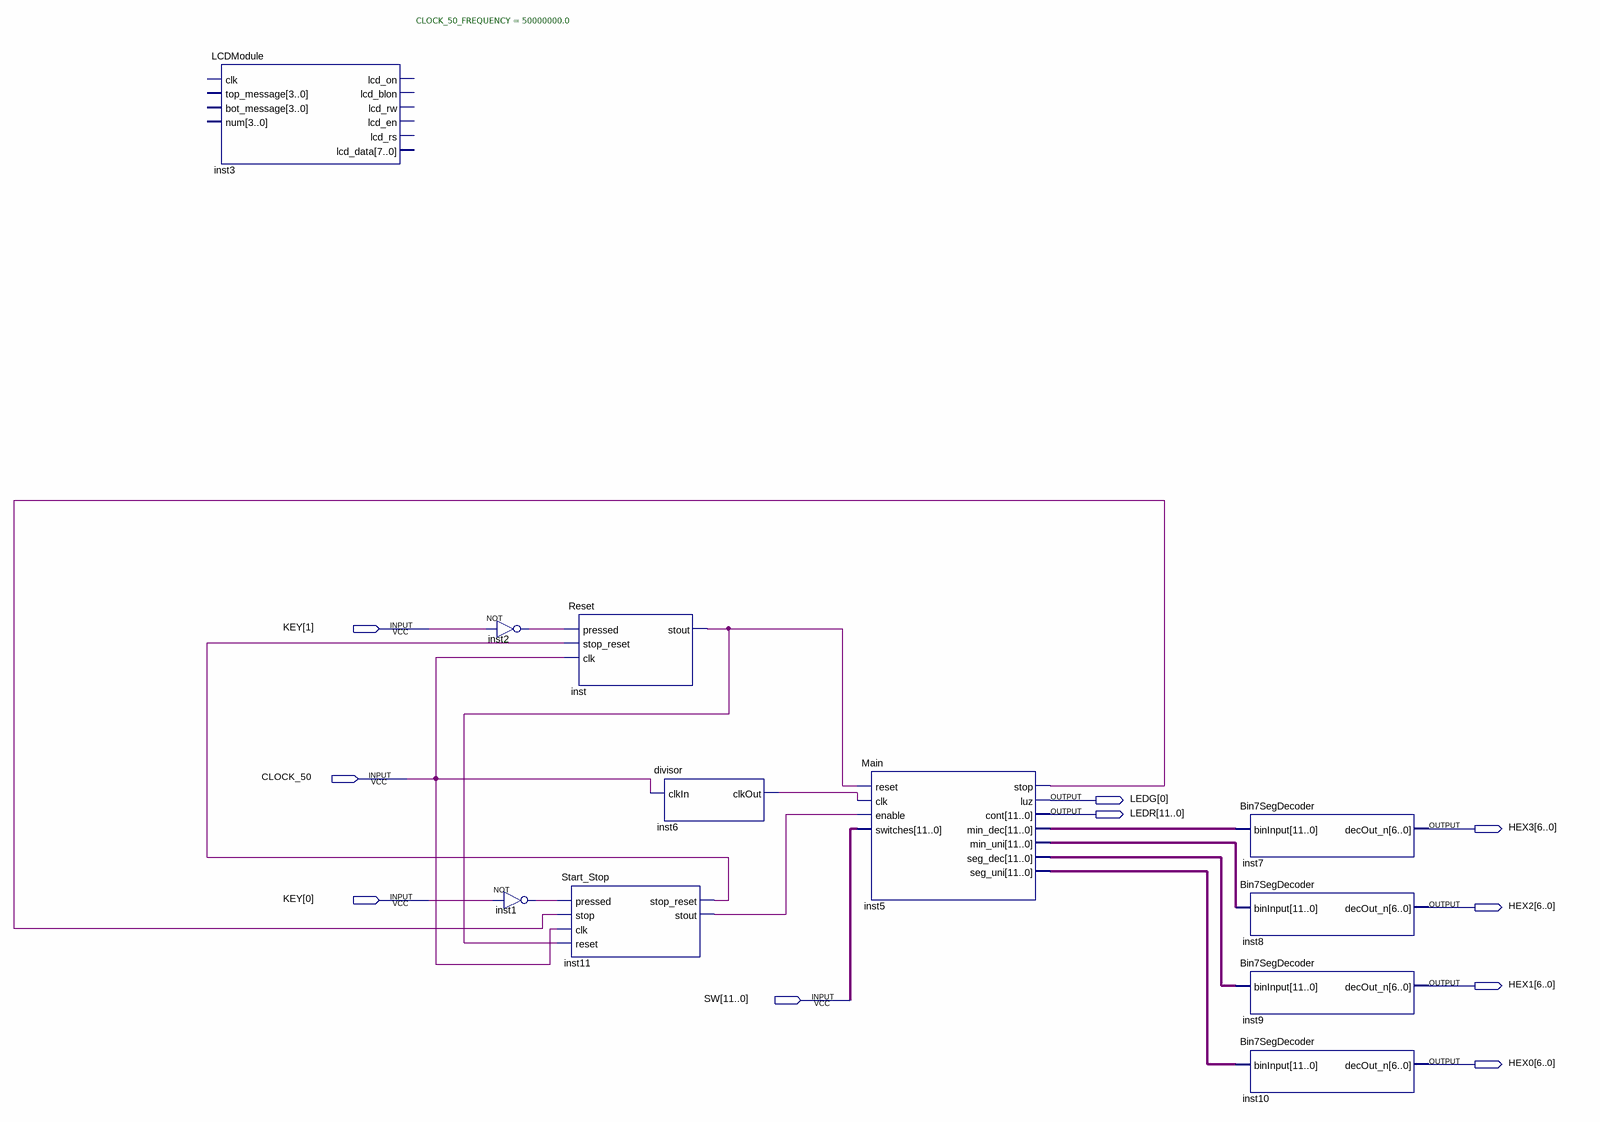
[diagram p0: schematic sheet]
// Quartus schematic fase2f.bdf as structural Verilog: 11 symbols, 10 pins
module fase2f (
  input  [1:0] KEY,
  input  CLOCK_50,
  input  [11:0] SW,
  output [0:0] LEDG,
  output [11:0] LEDR,
  output [6:0] HEX3,
  output [6:0] HEX2,
  output [6:0] HEX1,
  output [6:0] HEX0
);

  wire inst1_out, inst2_out, inst5_stop, inst6_clkout, inst11_stop_reset, inst11_stout, inst_stout;
  wire [11:0] inst5_min_dec, inst5_min_uni, inst5_seg_dec, inst5_seg_uni;

  LCDModule #(.CLOCK_50_FREQUENCY(50000000.0)) inst3 ();  // open: clk, top_message, bot_message, num, lcd_on, lcd_blon, lcd_rw, lcd_en, lcd_rs, lcd_data
  not inst2 (inst2_out, KEY[1]);
  not inst1 (inst1_out, KEY[0]);
  Reset inst (.pressed(inst2_out), .stop_reset(inst11_stop_reset), .clk(CLOCK_50), .stout(inst_stout));
  Start_Stop inst11 (
    .pressed(inst1_out), .stop(inst5_stop), .clk(CLOCK_50), .reset(inst_stout),
    .stop_reset(inst11_stop_reset), .stout(inst11_stout));
  divisor inst6 (.clkIn(CLOCK_50), .clkOut(inst6_clkout));
  Main inst5 (
    .reset(inst_stout), .clk(inst6_clkout), .enable(inst11_stout), .switches(SW), .stop(inst5_stop),
    .luz(LEDG[0]), .cont(LEDR), .min_dec(inst5_min_dec), .min_uni(inst5_min_uni), .seg_dec(inst5_seg_dec),
    .seg_uni(inst5_seg_uni));
  Bin7SegDecoder inst7 (.binInput(inst5_min_dec), .decOut_n(HEX3));
  Bin7SegDecoder inst8 (.binInput(inst5_min_uni), .decOut_n(HEX2));
  Bin7SegDecoder inst9 (.binInput(inst5_seg_dec), .decOut_n(HEX1));
  Bin7SegDecoder inst10 (.binInput(inst5_seg_uni), .decOut_n(HEX0));
endmodule
